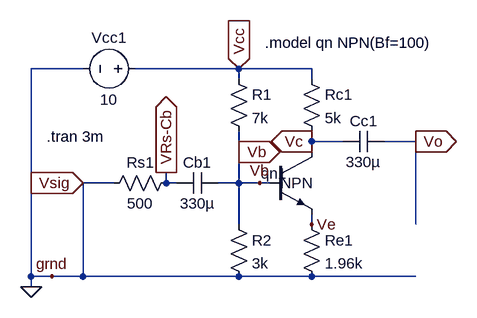
[diagram p0: schematic Draft1.asc]
Draft1.asc, the LTspice schematic file:
Version 4
SHEET 1 880 680
WIRE -16 32 -96 32
WIRE 224 32 64 32
WIRE 336 32 224 32
WIRE 224 48 224 32
WIRE 336 48 336 32
WIRE 336 144 336 128
WIRE 384 144 336 144
WIRE 496 144 448 144
WIRE 224 160 224 128
WIRE 336 160 336 144
WIRE 32 208 -16 208
WIRE 112 208 112 192
WIRE 128 208 112 208
WIRE 224 208 224 160
WIRE 224 208 192 208
WIRE 256 208 224 208
WIRE 272 208 256 208
WIRE 224 272 224 208
WIRE 336 272 336 256
WIRE 496 272 496 144
WIRE -96 352 -96 32
WIRE -64 352 -96 352
WIRE -16 352 -16 208
WIRE -16 352 -64 352
WIRE 224 352 -16 352
WIRE 336 352 224 352
WIRE 496 352 336 352
WIRE -96 368 -96 352
FLAG -16 208 Vsig
IOPIN -16 208 In
FLAG 112 192 VRs-Cb
IOPIN 112 192 Out
FLAG 224 160 Vb
IOPIN 224 160 Out
FLAG 336 144 Vc
IOPIN 336 144 Out
FLAG 496 144 Vo
IOPIN 496 144 Out
FLAG 224 32 Vcc
IOPIN 224 32 In
FLAG -64 352 grnd
FLAG -96 368 0
FLAG 336 272 Ve
FLAG 256 208 Vb
SYMBOL voltage 80 32 R90
WINDOW 0 -32 56 VBottom 2
WINDOW 3 32 56 VTop 2
SYMATTR InstName Vcc1
SYMATTR Value 10
SYMBOL res 320 32 R0
SYMATTR InstName Rc1
SYMATTR Value 5k
SYMBOL res 208 32 R0
SYMATTR InstName R1
SYMATTR Value 7k
SYMBOL cap 448 128 R90
WINDOW 0 0 32 VBottom 2
WINDOW 3 32 32 VTop 2
SYMATTR InstName Cc1
SYMATTR Value 330µ
SYMBOL cap 192 192 R90
WINDOW 0 0 32 VBottom 2
WINDOW 3 32 32 VTop 2
SYMATTR InstName Cb1
SYMATTR Value 330µ
SYMBOL res 16 224 R270
WINDOW 0 32 56 VTop 2
WINDOW 3 0 56 VBottom 2
SYMATTR InstName Rs1
SYMATTR Value 500
SYMBOL res 208 256 R0
SYMATTR InstName R2
SYMATTR Value 3k
SYMBOL res 320 256 R0
SYMATTR InstName Re1
SYMATTR Value 1.96k
SYMBOL npn 272 160 R0
WINDOW 0 -14 33 Left 2
WINDOW 3 16 48 Left 2
SYMATTR InstName qn1
TEXT 264 -8 Left 2 !.model qn NPN(Bf=100)
TEXT -72 136 Left 2 !.tran 3m

The netlist it stands for:
* Draft1.asc
Vcc1 Vcc 0 10
Rc1 Vcc Vc 5k
R1 Vcc Vb 7k
Cc1 Vo Vc 330µ
Cb1 Vb VRs-Cb 330µ
Rs1 0 VRs-Cb 500
R2 Vb 0 3k
Re1 Ve 0 1.96k
qn1 Vc Vb Ve 0 NPN
.model NPN NPN
.model PNP PNP
.lib standard.bjt
.model qn NPN(Bf=100)
.tran 3m
.backanno
.end